# EAGLE schematic orienteringsklokke (EAGLE 6.5.0)

## Sheet 1 of 2
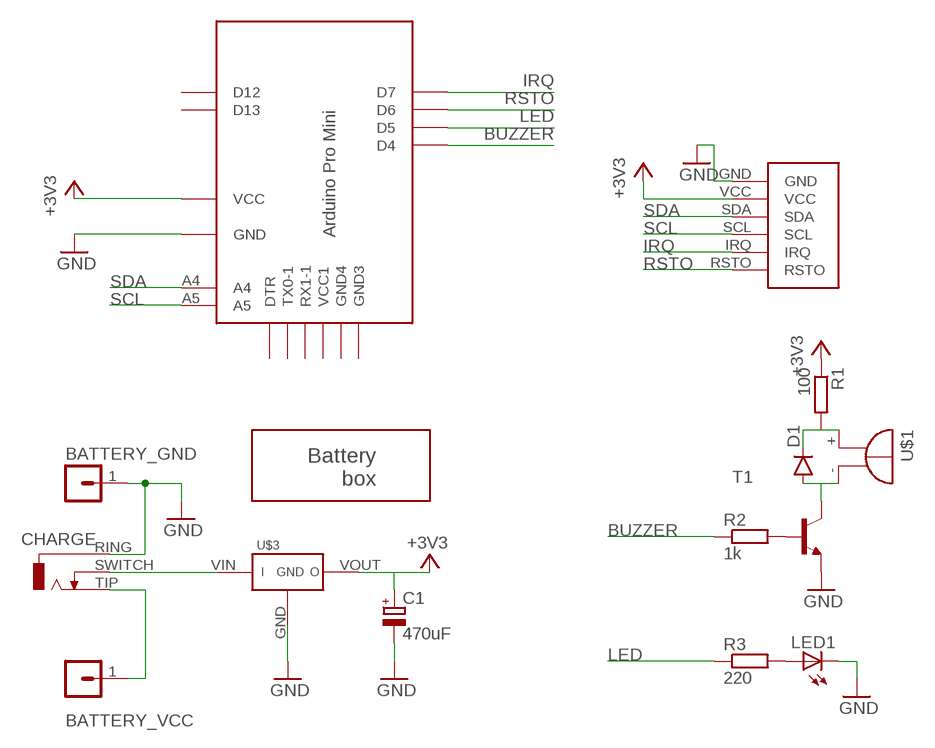
[diagram p0: schematic, sheet 1]

### Parts
BATTERY_GND  MA01-1JC  [MA01-1J]
BATTERY_VCC  MA01-1JC  [MA01-1J]
C1  470uF  CPOL-EUE2.5-6  [E2,5-6]
CHARGE  ST613-JACK  [ST613-JACK]
D1  1N4148DOJ35-5  [DO35-5J]
LED1  LED3MM  [LED3MM]
R1  100  R-EU_0207/7  [0207/7]
R2  1k  R-EU_0207/7  [0207/7]
R3  220  R-EU_0207/7  [0207/7]
T1  2N3904-NPN-TO92-EBC  [TO92-EBC]
U$1  BUZZER_J  [BUZZER_J]
U$2  NFC_MODULE_V3_I2C  [NFC_MODULE_V3_I2C]
U$3  VOLT_BOOST  [VOLT-BOOST]
U$4  ARD-PRO-MINI-ORIENTERING  [ARD_PRO_MINI_ORIENTERING]
U$5  BATTERY-BOX  [AAA-BATTERY-BOX-SINGLE]

### Nets
+3V3: C1.+ R1.1 U$2.VCC U$3.VOUT U$4.VCC
BUZZER: R2.1 U$4.D4
GND: BATTERY_GND.1 C1.- CHARGE.RING LED1.K(C) T1.E U$2.GND U$3.GND U$4.GND
IRQ: U$2.IRQ U$4.D7
LED: R3.1 U$4.D5
N$2: D1.A T1.C U$1.-
N$3: R2.2 T1.B
N$4: D1.C R1.2 U$1.+
N$5: LED1.A R3.2
N$6: BATTERY_VCC.1 CHARGE.TIP
N$7: CHARGE.SWITCH U$3.VIN
RSTO: U$2.RSTO U$4.D6
SCL: U$2.SCL U$4.A5
SDA: U$2.SDA U$4.A4
Unconnected: U$4.D12 U$4.D13 U$4.DTR U$4.GND2(GND3) U$4.GND3(GND4) U$4.RX1-1 U$4.TX0-1 U$4.VCC1

## Sheet 2 of 2

## Library data of the parts
BATTERY_GND BATTERY_VCC = joakim:MA01-1J: PIN HEADER
C1 = resistor:CPOL-EU: POLARIZED CAPACITOR, European symbol
CHARGE = joakim:ST613-JACK
D1 = joakim:1N4148: DIODE high speed (Philips)
LED1 = led:LED: LED OSRAM: - CHIPLED LG R971, LG N971, LY N971, LG Q971, LY Q971, LO R971, LY R971 LH N974, LH R974 LS Q976, LO Q976, LY Q976 LO Q996 - Hyper CHIPLED LW Q18S LB Q993, LB Q99A, LB R99A - SideLED LS A670, LO A670, LY A670, LG A670, LP A670 LB A673, LV A673, LT A673, LW A673 LH A674 LY A675 LS A676, LA A676, LO A676, LY A676, LW A676 LS A679, LY A679, LG A679 - Hyper Micro SIDELED® LS Y876, LA Y876, LO Y876, LY Y876 LT Y87S - SmartLED LW L88C, LW L88S LB L89C, LB L89S, LG L890 LS L89K, LO L89K, LY L89K LS L896, LA L896, LO L896, LY L896 - TOPLED LS T670, LO T670, LY T670, LG T670, LP T670 LSG T670, LSP T670, LSY T670, LOP T670, LYG T670 LG T671, LOG T671, LSG T671 LB T673, LV T673, LT T673, LW T673 LH T674 LS T676, LA T676, LO T676, LY T676, LB T676, LH T676, LSB T676, LW T676 LB T67C, LV T67C, LT T67C, LS T67K, LO T67K, LY T67K, LW E67C LS E67B, LA E67B, LO E67B, LY E67B, LB E67C, LV E67C, LT E67C LW T67C LS T679, LY T679, LG T679 LS T770, LO T770, LY T770, LG T770, LP T770 LB T773, LV T773, LT T773, LW T773 LH T774 LS E675, LA E675, LY E675, LS T675 LS T776, LA T776, LO T776, LY T776, LB T776 LHGB T686 LT T68C, LB T68C - Hyper Mini TOPLED® LB M676 - Mini TOPLED Santana® LG M470 LS M47K, LO M47K, LY M47K Source: http://www.osram.convergy.de LUXEON: - LUMILED® LXK2-PW12-R00, LXK2-PW12-S00, LXK2-PW14-U00, LXK2-PW14-V00 LXK2-PM12-R00, LXK2-PM12-S00, LXK2-PM14-U00 LXK2-PE12-Q00, LXK2-PE12-R00, LXK2-PE12-S00, LXK2-PE14-T00, LXK2-PE14-U00 LXK2-PB12-K00, LXK2-PB12-L00, LXK2-PB12-M00, LXK2-PB14-N00, LXK2-PB14-P00, LXK2-PB14-Q00 LXK2-PR12-L00, LXK2-PR12-M00, LXK2-PR14-Q00, LXK2-PR14-R00 LXK2-PD12-Q00, LXK2-PD12-R00, LXK2-PD12-S00 LXK2-PH12-R00, LXK2-PH12-S00 LXK2-PL12-P00, LXK2-PL12-Q00, LXK2-PL12-R00 Source: www.luxeon.com KINGBRIGHT: KA-3528ASYC Source: www.kingbright.com
R1-R3 = resistor:R-EU_: RESISTOR, European symbol
T1 = transistor-neu-to92:*-NPN-: NPN Transistror
U$1 = joakim:BUZZER_J
U$2 = joakim:NFC_MODULE_V3_I2C
U$3 = joakim:VOLT_BOOST
U$4 = joakim:ARD-PRO-MINI-ORIENTERING
U$5 = joakim:BATTERY-BOX